# EasyEDA Pro project ax08_duplicate.eprj, schematic ax08 1.0

## Sheets
1 register file: Board Name: ax08 1.0; Create Date: 2025-06-18; Page Name: register file; Project Name: ax08; Schematic Name: ax08 1.0; Update Date: 2025-06-18; Company: EasyEDA.com; Page Size: A4; Version: V1.0
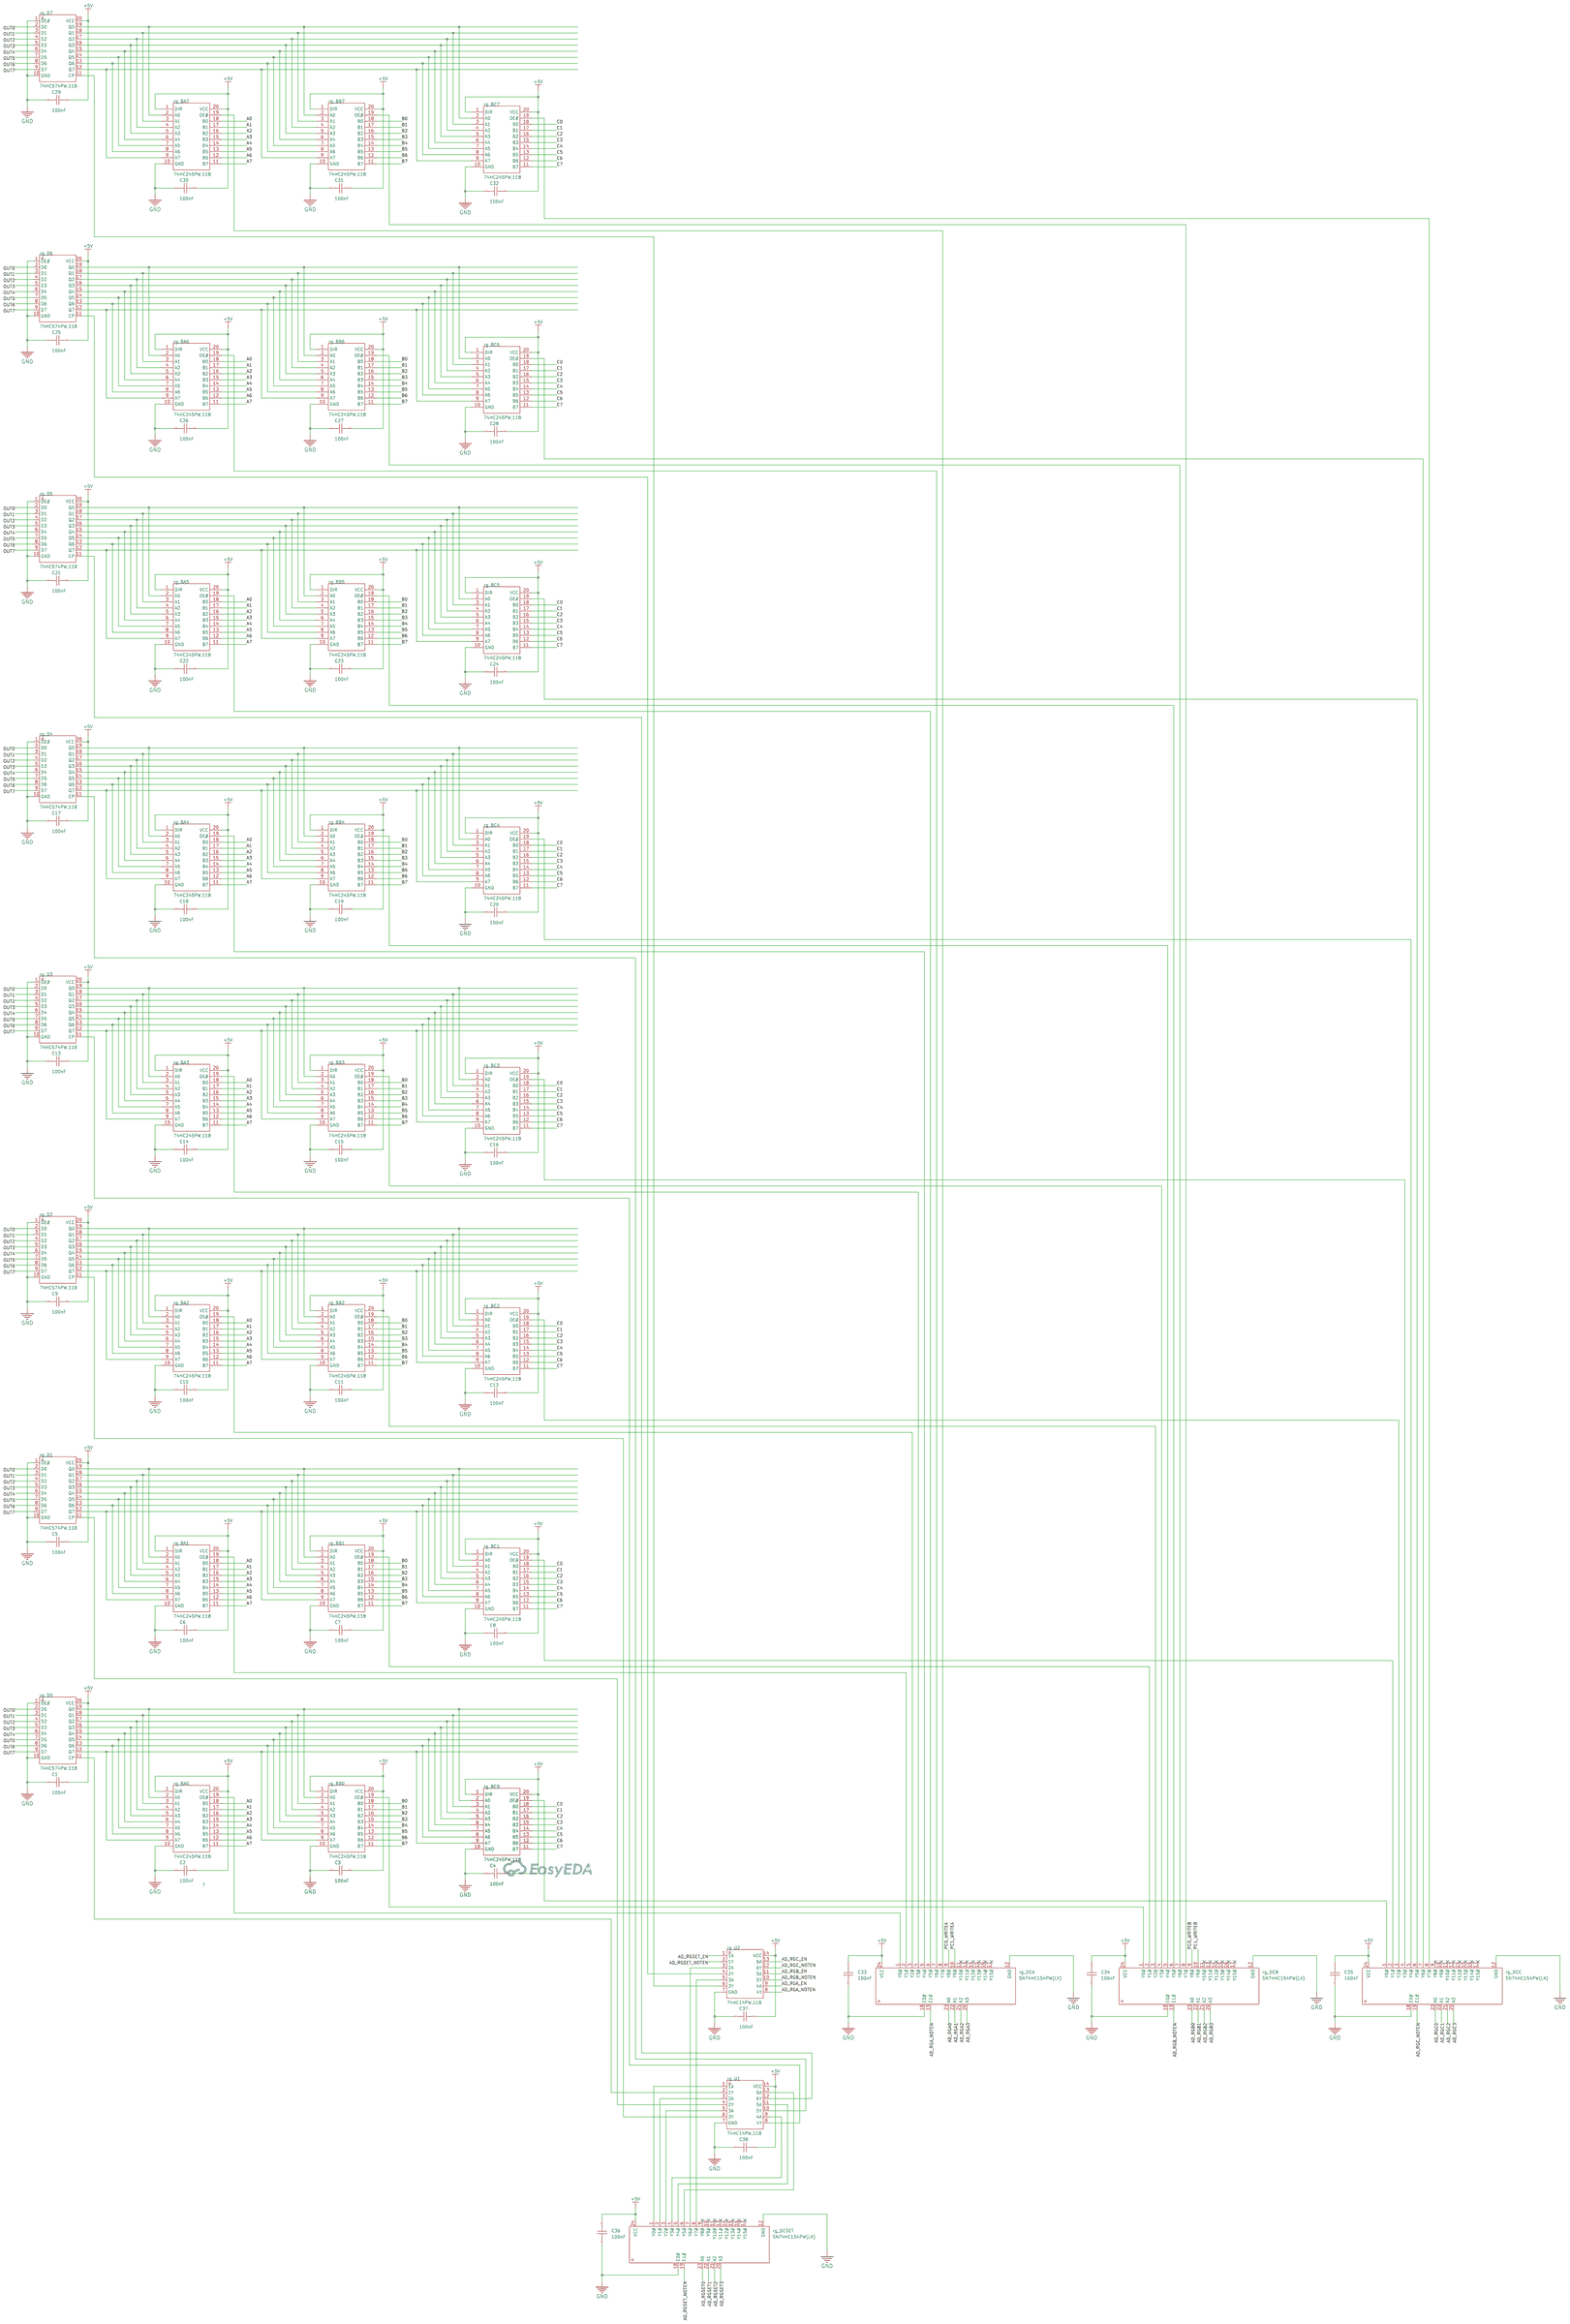
[diagram p0: register file]
2 pc: Page Name: pc
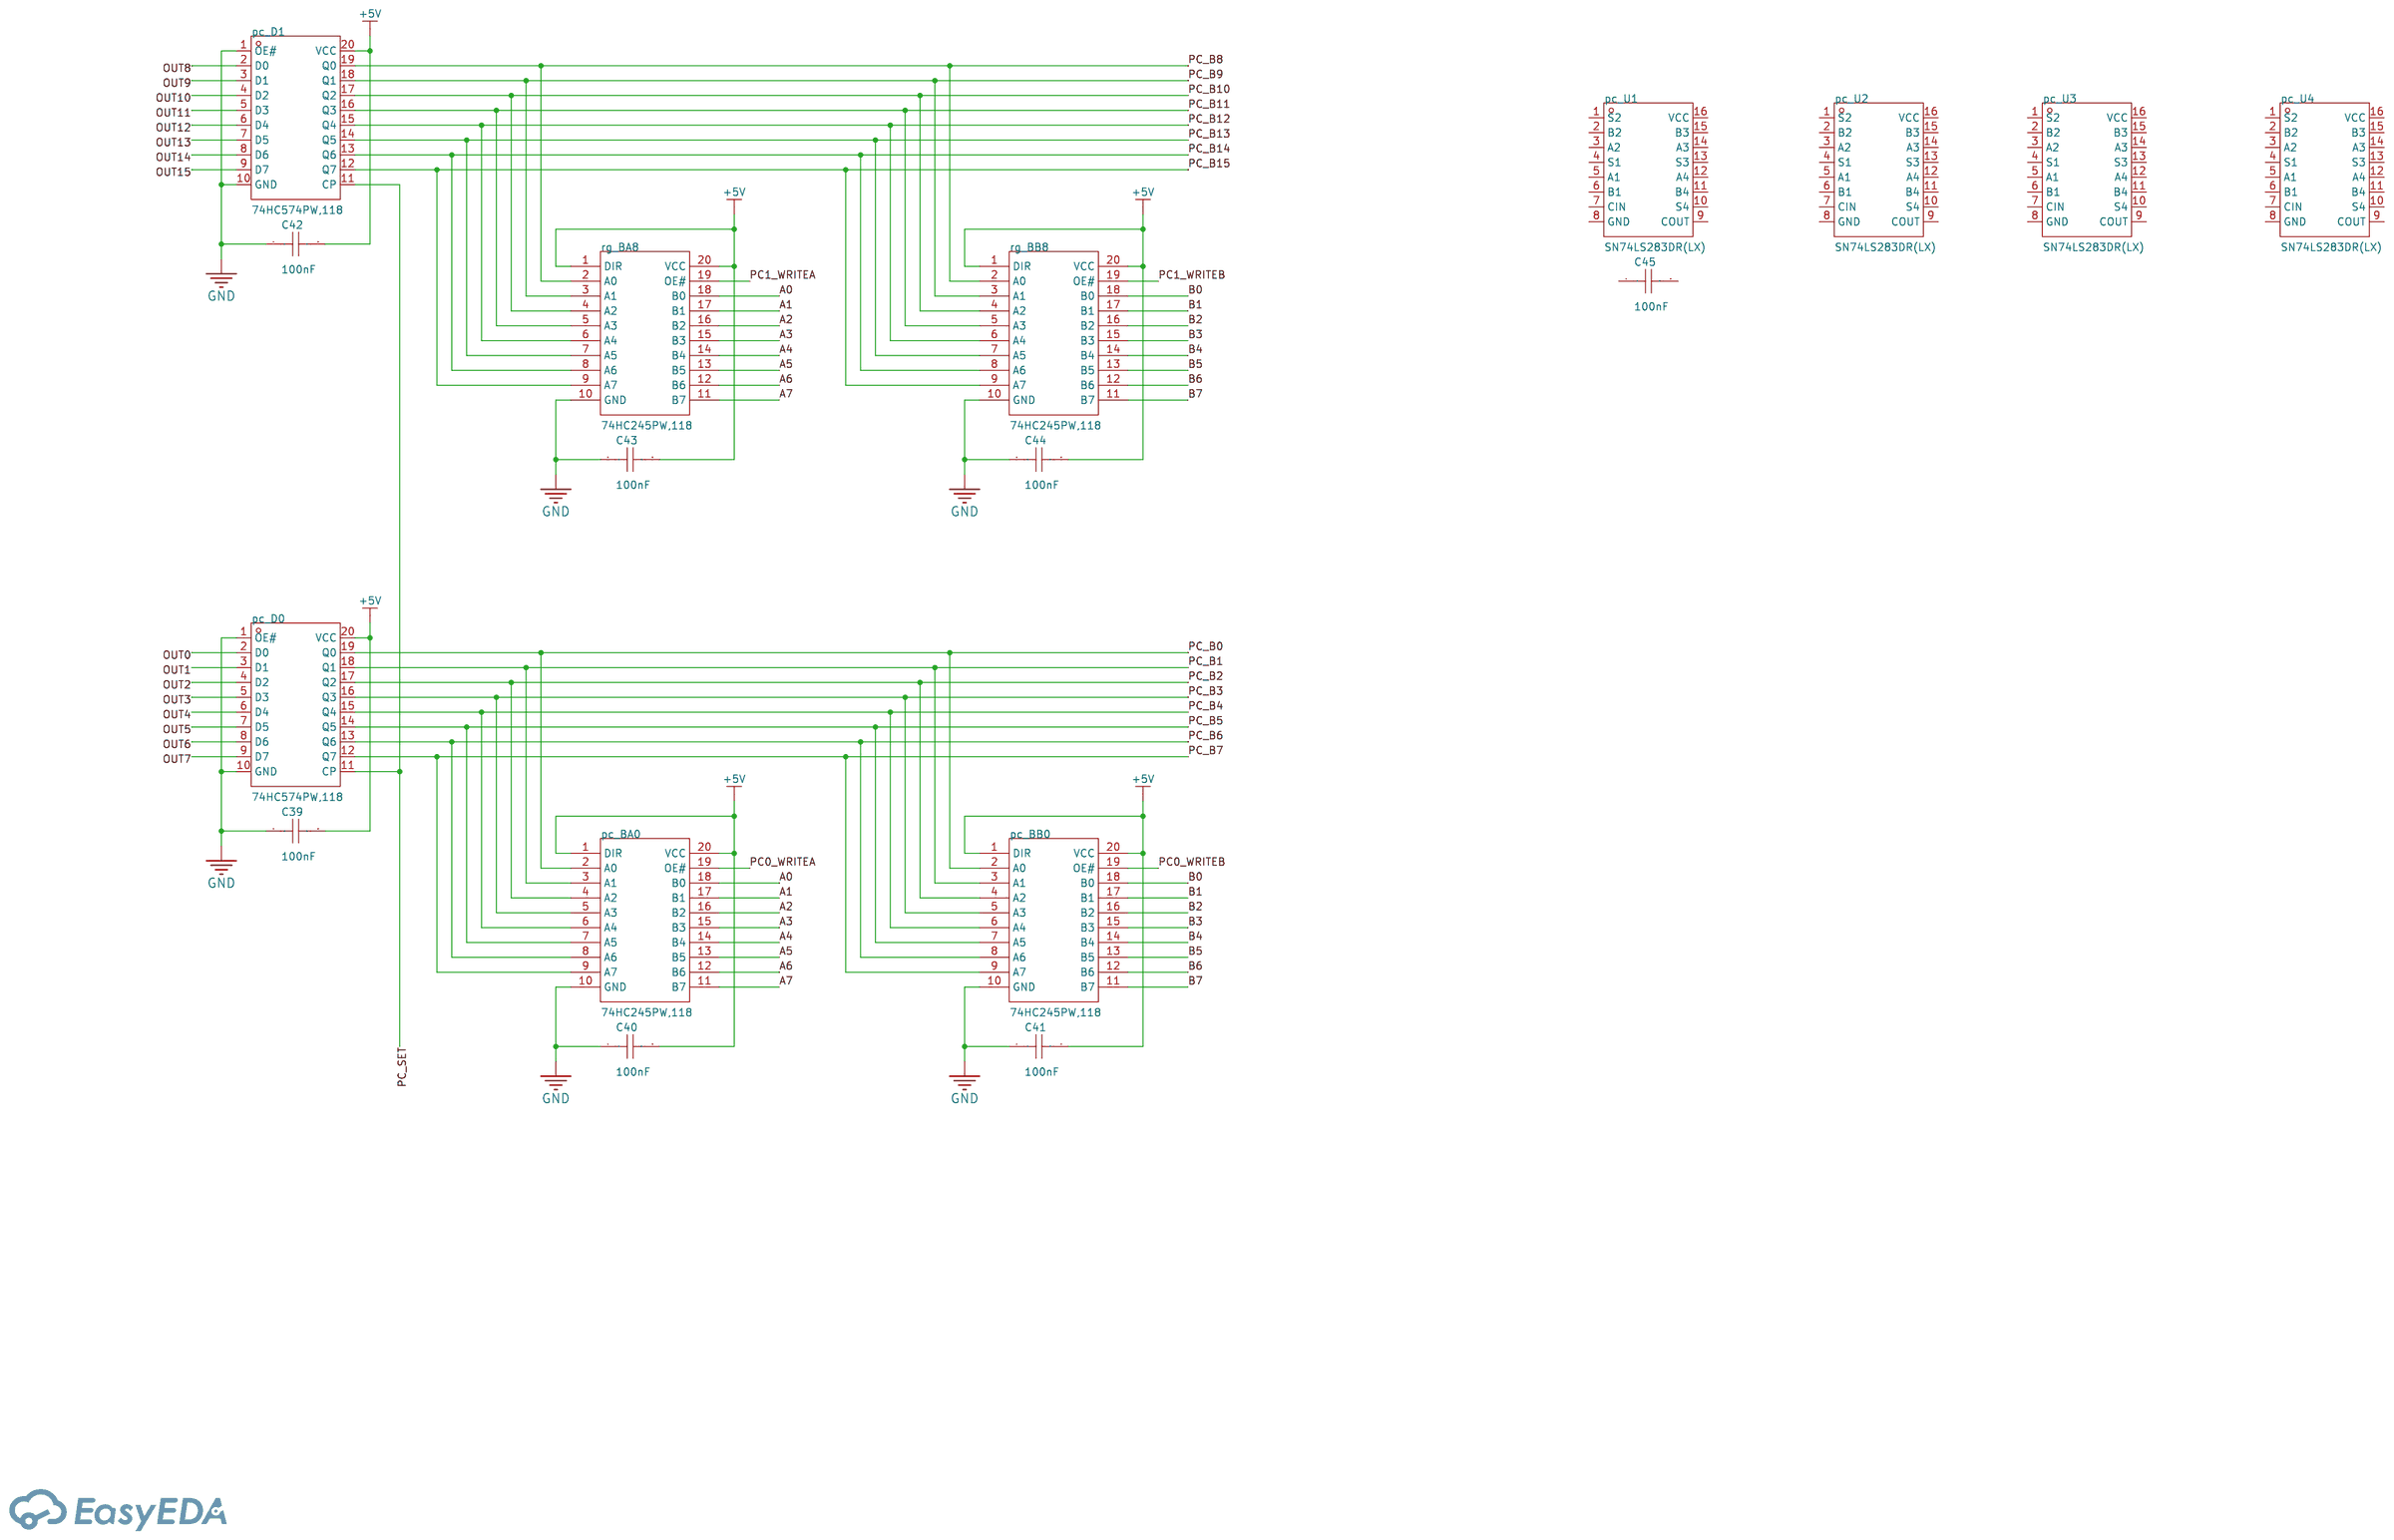
[diagram p1: pc]

## Parts
sheet pc
C39  100nF  [C0805]
C40  100nF  [C0805]
C41  100nF  [C0805]
C42  100nF  [C0805]
C43  100nF  [C0805]
C44  100nF  [C0805]
C45  100nF  [C0805]
pc_BA0  74HC245PW,118  [TSSOP-20_L6.5-W4.4-P0.65-LS6.4-BL]
pc_BB0  74HC245PW,118  [TSSOP-20_L6.5-W4.4-P0.65-LS6.4-BL]
pc_D0  74HC574PW,118  [TSSOP-20_L6.5-W4.4-P0.65-LS6.4-BL]
pc_D1  74HC574PW,118  [TSSOP-20_L6.5-W4.4-P0.65-LS6.4-BL]
pc_U1  SN74LS283DR(LX)  [SOIC-16_L9.9-W3.9-P1.27-LS6.0-BL-1]
pc_U2  SN74LS283DR(LX)  [SOIC-16_L9.9-W3.9-P1.27-LS6.0-BL-1]
pc_U3  SN74LS283DR(LX)  [SOIC-16_L9.9-W3.9-P1.27-LS6.0-BL-1]
pc_U4  SN74LS283DR(LX)  [SOIC-16_L9.9-W3.9-P1.27-LS6.0-BL-1]
rg_BA8  74HC245PW,118  [TSSOP-20_L6.5-W4.4-P0.65-LS6.4-BL]
rg_BB8  74HC245PW,118  [TSSOP-20_L6.5-W4.4-P0.65-LS6.4-BL]
sheet register file
C1  100nF  [C0805]
C2  100nF  [C0805]
C3  100nF  [C0805]
C4  100nF  [C0805]
C5  100nF  [C0805]
C6  100nF  [C0805]
C7  100nF  [C0805]
C8  100nF  [C0805]
C9  100nF  [C0805]
C10  100nF  [C0805]
C11  100nF  [C0805]
C12  100nF  [C0805]
C13  100nF  [C0805]
C14  100nF  [C0805]
C15  100nF  [C0805]
C16  100nF  [C0805]
C17  100nF  [C0805]
C18  100nF  [C0805]
C19  100nF  [C0805]
C20  100nF  [C0805]
C21  100nF  [C0805]
C22  100nF  [C0805]
C23  100nF  [C0805]
C24  100nF  [C0805]
C25  100nF  [C0805]
C26  100nF  [C0805]
C27  100nF  [C0805]
C28  100nF  [C0805]
C29  100nF  [C0805]
C30  100nF  [C0805]
C31  100nF  [C0805]
C32  100nF  [C0805]
C33  100nF  [C0805]
C34  100nF  [C0805]
C35  100nF  [C0805]
C36  100nF  [C0805]
C37  100nF  [C0805]
C38  100nF  [C0805]
rg_BA0  74HC245PW,118  [TSSOP-20_L6.5-W4.4-P0.65-LS6.4-BL]
rg_BA1  74HC245PW,118  [TSSOP-20_L6.5-W4.4-P0.65-LS6.4-BL]
rg_BA2  74HC245PW,118  [TSSOP-20_L6.5-W4.4-P0.65-LS6.4-BL]
rg_BA3  74HC245PW,118  [TSSOP-20_L6.5-W4.4-P0.65-LS6.4-BL]
rg_BA4  74HC245PW,118  [TSSOP-20_L6.5-W4.4-P0.65-LS6.4-BL]
rg_BA5  74HC245PW,118  [TSSOP-20_L6.5-W4.4-P0.65-LS6.4-BL]
rg_BA6  74HC245PW,118  [TSSOP-20_L6.5-W4.4-P0.65-LS6.4-BL]
rg_BA7  74HC245PW,118  [TSSOP-20_L6.5-W4.4-P0.65-LS6.4-BL]
rg_BB0  74HC245PW,118  [TSSOP-20_L6.5-W4.4-P0.65-LS6.4-BL]
rg_BB1  74HC245PW,118  [TSSOP-20_L6.5-W4.4-P0.65-LS6.4-BL]
rg_BB2  74HC245PW,118  [TSSOP-20_L6.5-W4.4-P0.65-LS6.4-BL]
rg_BB3  74HC245PW,118  [TSSOP-20_L6.5-W4.4-P0.65-LS6.4-BL]
rg_BB4  74HC245PW,118  [TSSOP-20_L6.5-W4.4-P0.65-LS6.4-BL]
rg_BB5  74HC245PW,118  [TSSOP-20_L6.5-W4.4-P0.65-LS6.4-BL]
rg_BB6  74HC245PW,118  [TSSOP-20_L6.5-W4.4-P0.65-LS6.4-BL]
rg_BB7  74HC245PW,118  [TSSOP-20_L6.5-W4.4-P0.65-LS6.4-BL]
rg_BC0  74HC245PW,118  [TSSOP-20_L6.5-W4.4-P0.65-LS6.4-BL]
rg_BC1  74HC245PW,118  [TSSOP-20_L6.5-W4.4-P0.65-LS6.4-BL]
rg_BC2  74HC245PW,118  [TSSOP-20_L6.5-W4.4-P0.65-LS6.4-BL]
rg_BC3  74HC245PW,118  [TSSOP-20_L6.5-W4.4-P0.65-LS6.4-BL]
rg_BC4  74HC245PW,118  [TSSOP-20_L6.5-W4.4-P0.65-LS6.4-BL]
rg_BC5  74HC245PW,118  [TSSOP-20_L6.5-W4.4-P0.65-LS6.4-BL]
rg_BC6  74HC245PW,118  [TSSOP-20_L6.5-W4.4-P0.65-LS6.4-BL]
rg_BC7  74HC245PW,118  [TSSOP-20_L6.5-W4.4-P0.65-LS6.4-BL]
rg_D0  74HC574PW,118  [TSSOP-20_L6.5-W4.4-P0.65-LS6.4-BL]
rg_D1  74HC574PW,118  [TSSOP-20_L6.5-W4.4-P0.65-LS6.4-BL]
rg_D2  74HC574PW,118  [TSSOP-20_L6.5-W4.4-P0.65-LS6.4-BL]
rg_D3  74HC574PW,118  [TSSOP-20_L6.5-W4.4-P0.65-LS6.4-BL]
rg_D4  74HC574PW,118  [TSSOP-20_L6.5-W4.4-P0.65-LS6.4-BL]
rg_D5  74HC574PW,118  [TSSOP-20_L6.5-W4.4-P0.65-LS6.4-BL]
rg_D6  74HC574PW,118  [TSSOP-20_L6.5-W4.4-P0.65-LS6.4-BL]
rg_D7  74HC574PW,118  [TSSOP-20_L6.5-W4.4-P0.65-LS6.4-BL]
rg_DCA  SN74HC154PW(LX)  [TSSOP-24_L7.8-W4.4-P0.65-LS6.4-BL_1]
rg_DCB  SN74HC154PW(LX)  [TSSOP-24_L7.8-W4.4-P0.65-LS6.4-BL_1]
rg_DCC  SN74HC154PW(LX)  [TSSOP-24_L7.8-W4.4-P0.65-LS6.4-BL_1]
rg_DCSET  SN74HC154PW(LX)  [TSSOP-24_L7.8-W4.4-P0.65-LS6.4-BL_1]
rg_U1  74HC14PW,118  [TSSOP-14_L5.0-W4.4-P0.65-LS6.4-BL]
rg_U2  74HC14PW,118  [TSSOP-14_L5.0-W4.4-P0.65-LS6.4-BL]

## Library data of the parts
C1-C45 = CC0805KRX7R9BB104: Capacitance: Tolerance:±10% Tolerance:±10% Voltage Rated: Temperature Coefficient:; LCSC Part Name: 100nF ±10% 50V; Supplier Part: C49678; Manufacturer: YAGEO(国巨); Supplier Footprint: 0805; JLCPCB Part Class: Basic Part; Datasheet: https://atta.szlcsc.com/upload/public/pdf/source/20180224/C181747_15194369449651363981.pdf; Supplier: LCSC; Tolerance: ±10%
pc_BA0 pc_BB0 rg_BA0-rg_BA8 rg_BB0-rg_BB8 rg_BC0-rg_BC7 = 74HC245PW,118: Input type:- output type:Tri-State Supply Voltage:2V~6V Supply Voltage:2V~6V Number of Elements:1 Number of Bits per Element:8 Channel Type:- Sink Current:7.8mA Source Current:7.8mA Logic Family:74HC Operating Temperature:-40℃~+125℃ Operating Temperature:; Supplier Part: C5626; Manufacturer: Nexperia(安世); Supplier Footprint: TSSOP-20; JLCPCB Part Class: Extended Part; Datasheet: https://atta.szlcsc.com/upload/public/pdf/source/20240724/EDC8C45902BA97AEC59E8811E3964917.pdf; Supplier: LCSC; output type: Tri-State; Supply Voltage: 2V~6V; Number of Elements: 1; Number of Bits per Element: 8; Sink Current: 7.8mA; Source Current: 7.8mA; Logic Family: 74HC; Operating Temperature: -40℃~+125℃
pc_D0 pc_D1 rg_D0-rg_D7 = 74HC574PW,118: Type:D-Type Trigger Type:Rising Edge Supply Voltage:2V~6V Supply Voltage:2V~6V Clock Frequency:133MHz Function: Number of Elements:1 Number of Bits per Element:8 Output Type: Maximum Propagation Delay:26ns@6V,50pF Series:74HCSeries Sink Current:7.8mA Sour; Supplier Part: C93762; Manufacturer: Nexperia(安世); Supplier Footprint: TSSOP-20; JLCPCB Part Class: Extended Part; Datasheet: https://atta.szlcsc.com/upload/public/pdf/source/20230809/78F4E93A48B1813E6DF94573D4B43A3E.pdf; Supplier: LCSC; Type: D-Type; Trigger Type: Rising Edge; Supply Voltage: 2V~6V; Clock Frequency: 133MHz; Number of Elements: 1; Number of Bits per Element: 8; Maximum Propagation Delay: 26ns@6V,50pF; Series: 74HCSeries; Sink Current: 7.8mA; Source Current: 7.8mA; Quiescent Current (Iq): 8uA; Input Capacitance: 3.5pF; Operating Temperature: -40℃~+125℃
pc_U1-pc_U4 = SN74LS283DR(LX): Supplier Part: C22374103; Manufacturer: LX(灵星芯微); Supplier Footprint: SOP-16; JLCPCB Part Class: Extended Part; Datasheet: https://atta.szlcsc.com/upload/public/pdf/source/20240402/80BBEEF0EDCF1C8215BAA06339FE4235.pdf; Supplier: LCSC; Logic Type: Binary Full Adder; Number of Channels: 4; Supply Voltage: 2V~6V; Operating Temperature: -40℃~+125℃
rg_DCA rg_DCB rg_DCC rg_DCSET = SN74HC154PW(LX): Type:Decoder/Demultiplexers Voltage Supply Source:Single supply Supply Voltage:2V~6V Supply Voltage:2V~6V Number of lines:4~16 Number of lines:4~16 Sink Current:- Source Current:- Operating temperature:-40℃~+125℃ Operating temperature:-40℃~+125℃; Supplier Part: C41413100; Manufacturer: LX(灵星芯微); Supplier Footprint: TSSOP-24; JLCPCB Part Class: Extended Part; Datasheet: https://atta.szlcsc.com/upload/public/pdf/source/20240923/0BF8EBFBC2EE7843BBF2E86797CF806E.pdf; Supplier: LCSC; Type: Decoder/Demultiplexers; Voltage Supply Source: Single supply; Supply Voltage: 2V~6V; Number of lines: 4~16; Operating temperature: -40℃~+125℃
rg_U1 rg_U2 = 74HC14PW,118: Input Type:Schmitt Trigger Supply Voltage(Single):2V~6V Supply Voltage(Single):2V~6V Supply Current (Max):2uA Number of Circuits:6 Number of Inputs:1 Sink Current:5.2mA Source Current:5.2mA High level range (VIH):1.5V~4.2V High level range (VIH):1.5V~4.2V; LCSC Part Name: 六路施密特触发反相器; Supplier Part: C5606; Manufacturer: Nexperia(安世); Supplier Footprint: TSSOP-14; JLCPCB Part Class: Extended Part; Datasheet: https://atta.szlcsc.com/upload/public/pdf/source/20170918/C131315_1505726904049976307.pdf; Supplier: LCSC; Input Type: Schmitt Trigger; Supply Voltage(Single): 2V~6V; Supply Current (Max): 2uA; Number of Circuits: 6; Number of Inputs: 1; Sink Current: 5.2mA; Source Current: 5.2mA; High level range (VIH): 1.5V~4.2V; Low level range (VIL): 300mV~1.2V; Max Propagation Delay: 21ns@6V,50pF; Series: 74HCSeries; Operating Temperature: -40℃~+125℃

## Nets
+5V: C1.2 C2.2 C3.2 C4.2 C5.2 C6.2 C7.2 C8.2 C9.2 C10.2 C11.2 C12.2 C13.2 C14.2 C15.2 C16.2 C17.2 C18.2 C19.2 C20.2 C21.2 C22.2 C23.2 C24.2 C25.2 C26.2 C27.2 C28.2 C29.2 C30.2 C31.2 C32.2 C33.1 C34.1 C35.1 C36.1 C37.2 C38.2 C39.2 C40.2 C41.2 C42.2 C43.2 C44.2 pc_BA0.1(DIR) pc_BA0.20(VCC) pc_BB0.1(DIR) pc_BB0.20(VCC) pc_D0.20(VCC) pc_D1.20(VCC) rg_BA0.1(DIR) rg_BA0.20(VCC) rg_BA1.1(DIR) rg_BA1.20(VCC) rg_BA2.1(DIR) rg_BA2.20(VCC) rg_BA3.1(DIR) rg_BA3.20(VCC) rg_BA4.1(DIR) rg_BA4.20(VCC) rg_BA5.1(DIR) rg_BA5.20(VCC) rg_BA6.1(DIR) rg_BA6.20(VCC) rg_BA7.1(DIR) rg_BA7.20(VCC) rg_BA8.1(DIR) rg_BA8.20(VCC) rg_BB0.1(DIR) rg_BB0.20(VCC) rg_BB1.1(DIR) rg_BB1.20(VCC) rg_BB2.1(DIR) rg_BB2.20(VCC) rg_BB3.1(DIR) rg_BB3.20(VCC) rg_BB4.1(DIR) rg_BB4.20(VCC) rg_BB5.1(DIR) rg_BB5.20(VCC) rg_BB6.1(DIR) rg_BB6.20(VCC) rg_BB7.1(DIR) rg_BB7.20(VCC) rg_BB8.1(DIR) rg_BB8.20(VCC) rg_BC0.1(DIR) rg_BC0.20(VCC) rg_BC1.1(DIR) rg_BC1.20(VCC) rg_BC2.1(DIR) rg_BC2.20(VCC) rg_BC3.1(DIR) rg_BC3.20(VCC) rg_BC4.1(DIR) rg_BC4.20(VCC) rg_BC5.1(DIR) rg_BC5.20(VCC) rg_BC6.1(DIR) rg_BC6.20(VCC) rg_BC7.1(DIR) rg_BC7.20(VCC) rg_D0.20(VCC) rg_D1.20(VCC) rg_D2.20(VCC) rg_D3.20(VCC) rg_D4.20(VCC) rg_D5.20(VCC) rg_D6.20(VCC) rg_D7.20(VCC) rg_DCA.24(VCC) rg_DCB.24(VCC) rg_DCC.24(VCC) rg_DCSET.24(VCC) rg_U1.14(VCC) rg_U2.14(VCC)
GND: C1.1 C2.1 C3.1 C4.1 C5.1 C6.1 C7.1 C8.1 C9.1 C10.1 C11.1 C12.1 C13.1 C14.1 C15.1 C16.1 C17.1 C18.1 C19.1 C20.1 C21.1 C22.1 C23.1 C24.1 C25.1 C26.1 C27.1 C28.1 C29.1 C30.1 C31.1 C32.1 C33.2 C34.2 C35.2 C36.2 C37.1 C38.1 C39.1 C40.1 C41.1 C42.1 C43.1 C44.1 pc_BA0.10(GND) pc_BB0.10(GND) pc_D0.1(OE#) pc_D0.10(GND) pc_D1.1(OE#) pc_D1.10(GND) rg_BA0.10(GND) rg_BA1.10(GND) rg_BA2.10(GND) rg_BA3.10(GND) rg_BA4.10(GND) rg_BA5.10(GND) rg_BA6.10(GND) rg_BA7.10(GND) rg_BA8.10(GND) rg_BB0.10(GND) rg_BB1.10(GND) rg_BB2.10(GND) rg_BB3.10(GND) rg_BB4.10(GND) rg_BB5.10(GND) rg_BB6.10(GND) rg_BB7.10(GND) rg_BB8.10(GND) rg_BC0.10(GND) rg_BC1.10(GND) rg_BC2.10(GND) rg_BC3.10(GND) rg_BC4.10(GND) rg_BC5.10(GND) rg_BC6.10(GND) rg_BC7.10(GND) rg_D0.1(OE#) rg_D0.10(GND) rg_D1.1(OE#) rg_D1.10(GND) rg_D2.1(OE#) rg_D2.10(GND) rg_D3.1(OE#) rg_D3.10(GND) rg_D4.1(OE#) rg_D4.10(GND) rg_D5.1(OE#) rg_D5.10(GND) rg_D6.1(OE#) rg_D6.10(GND) rg_D7.1(OE#) rg_D7.10(GND) rg_DCA.12(GND) rg_DCA.18(E0#) rg_DCB.12(GND) rg_DCB.18(E0#) rg_DCC.12(GND) rg_DCC.18(E0#) rg_DCSET.12(GND) rg_DCSET.18(E0#) rg_U1.7(GND) rg_U2.7(GND)
A0: pc_BA0.18(B0) rg_BA0.18(B0) rg_BA1.18(B0) rg_BA2.18(B0) rg_BA3.18(B0) rg_BA4.18(B0) rg_BA5.18(B0) rg_BA6.18(B0) rg_BA7.18(B0) rg_BA8.18(B0)
A1: pc_BA0.17(B1) rg_BA0.17(B1) rg_BA1.17(B1) rg_BA2.17(B1) rg_BA3.17(B1) rg_BA4.17(B1) rg_BA5.17(B1) rg_BA6.17(B1) rg_BA7.17(B1) rg_BA8.17(B1)
A2: pc_BA0.16(B2) rg_BA0.16(B2) rg_BA1.16(B2) rg_BA2.16(B2) rg_BA3.16(B2) rg_BA4.16(B2) rg_BA5.16(B2) rg_BA6.16(B2) rg_BA7.16(B2) rg_BA8.16(B2)
A3: pc_BA0.15(B3) rg_BA0.15(B3) rg_BA1.15(B3) rg_BA2.15(B3) rg_BA3.15(B3) rg_BA4.15(B3) rg_BA5.15(B3) rg_BA6.15(B3) rg_BA7.15(B3) rg_BA8.15(B3)
A4: pc_BA0.14(B4) rg_BA0.14(B4) rg_BA1.14(B4) rg_BA2.14(B4) rg_BA3.14(B4) rg_BA4.14(B4) rg_BA5.14(B4) rg_BA6.14(B4) rg_BA7.14(B4) rg_BA8.14(B4)
A5: pc_BA0.13(B5) rg_BA0.13(B5) rg_BA1.13(B5) rg_BA2.13(B5) rg_BA3.13(B5) rg_BA4.13(B5) rg_BA5.13(B5) rg_BA6.13(B5) rg_BA7.13(B5) rg_BA8.13(B5)
A6: pc_BA0.12(B6) rg_BA0.12(B6) rg_BA1.12(B6) rg_BA2.12(B6) rg_BA3.12(B6) rg_BA4.12(B6) rg_BA5.12(B6) rg_BA6.12(B6) rg_BA7.12(B6) rg_BA8.12(B6)
A7: pc_BA0.11(B7) rg_BA0.11(B7) rg_BA1.11(B7) rg_BA2.11(B7) rg_BA3.11(B7) rg_BA4.11(B7) rg_BA5.11(B7) rg_BA6.11(B7) rg_BA7.11(B7) rg_BA8.11(B7)
AD_RGA0: rg_DCA.23(A0)
AD_RGA1: rg_DCA.22(A1)
AD_RGA2: rg_DCA.21(A2)
AD_RGA3: rg_DCA.20(A3)
AD_RGA_EN: rg_U2.9(4A)
AD_RGA_NOTEN: rg_DCA.19(E1#) rg_U2.8(4Y)
AD_RGB0: rg_DCB.23(A0)
AD_RGB1: rg_DCB.22(A1)
AD_RGB2: rg_DCB.21(A2)
AD_RGB3: rg_DCB.20(A3)
AD_RGB_EN: rg_U2.11(5A)
AD_RGB_NOTEN: rg_DCB.19(E1#) rg_U2.10(5Y)
AD_RGC0: rg_DCC.23(A0)
AD_RGC1: rg_DCC.22(A1)
AD_RGC2: rg_DCC.21(A2)
AD_RGC3: rg_DCC.20(A3)
AD_RGC_EN: rg_U2.13(6A)
AD_RGC_NOTEN: rg_DCC.19(E1#) rg_U2.12(6Y)
AD_RGSET0: rg_DCSET.23(A0)
AD_RGSET1: rg_DCSET.22(A1)
AD_RGSET2: rg_DCSET.21(A2)
AD_RGSET3: rg_DCSET.20(A3)
AD_RGSET_EN: rg_U2.1(1A)
AD_RGSET_NOTEN: rg_DCSET.19(E1#) rg_U2.2(1Y)
B0: pc_BB0.18(B0) rg_BB0.18(B0) rg_BB1.18(B0) rg_BB2.18(B0) rg_BB3.18(B0) rg_BB4.18(B0) rg_BB5.18(B0) rg_BB6.18(B0) rg_BB7.18(B0) rg_BB8.18(B0)
B1: pc_BB0.17(B1) rg_BB0.17(B1) rg_BB1.17(B1) rg_BB2.17(B1) rg_BB3.17(B1) rg_BB4.17(B1) rg_BB5.17(B1) rg_BB6.17(B1) rg_BB7.17(B1) rg_BB8.17(B1)
B2: pc_BB0.16(B2) rg_BB0.16(B2) rg_BB1.16(B2) rg_BB2.16(B2) rg_BB3.16(B2) rg_BB4.16(B2) rg_BB5.16(B2) rg_BB6.16(B2) rg_BB7.16(B2) rg_BB8.16(B2)
B3: pc_BB0.15(B3) rg_BB0.15(B3) rg_BB1.15(B3) rg_BB2.15(B3) rg_BB3.15(B3) rg_BB4.15(B3) rg_BB5.15(B3) rg_BB6.15(B3) rg_BB7.15(B3) rg_BB8.15(B3)
B4: pc_BB0.14(B4) rg_BB0.14(B4) rg_BB1.14(B4) rg_BB2.14(B4) rg_BB3.14(B4) rg_BB4.14(B4) rg_BB5.14(B4) rg_BB6.14(B4) rg_BB7.14(B4) rg_BB8.14(B4)
B5: pc_BB0.13(B5) rg_BB0.13(B5) rg_BB1.13(B5) rg_BB2.13(B5) rg_BB3.13(B5) rg_BB4.13(B5) rg_BB5.13(B5) rg_BB6.13(B5) rg_BB7.13(B5) rg_BB8.13(B5)
B6: pc_BB0.12(B6) rg_BB0.12(B6) rg_BB1.12(B6) rg_BB2.12(B6) rg_BB3.12(B6) rg_BB4.12(B6) rg_BB5.12(B6) rg_BB6.12(B6) rg_BB7.12(B6) rg_BB8.12(B6)
B7: pc_BB0.11(B7) rg_BB0.11(B7) rg_BB1.11(B7) rg_BB2.11(B7) rg_BB3.11(B7) rg_BB4.11(B7) rg_BB5.11(B7) rg_BB6.11(B7) rg_BB7.11(B7) rg_BB8.11(B7)
C0: rg_BC0.18(B0) rg_BC1.18(B0) rg_BC2.18(B0) rg_BC3.18(B0) rg_BC4.18(B0) rg_BC5.18(B0) rg_BC6.18(B0) rg_BC7.18(B0)
C1: rg_BC0.17(B1) rg_BC1.17(B1) rg_BC2.17(B1) rg_BC3.17(B1) rg_BC4.17(B1) rg_BC5.17(B1) rg_BC6.17(B1) rg_BC7.17(B1)
C2: rg_BC0.16(B2) rg_BC1.16(B2) rg_BC2.16(B2) rg_BC3.16(B2) rg_BC4.16(B2) rg_BC5.16(B2) rg_BC6.16(B2) rg_BC7.16(B2)
C3: rg_BC0.15(B3) rg_BC1.15(B3) rg_BC2.15(B3) rg_BC3.15(B3) rg_BC4.15(B3) rg_BC5.15(B3) rg_BC6.15(B3) rg_BC7.15(B3)
C4: rg_BC0.14(B4) rg_BC1.14(B4) rg_BC2.14(B4) rg_BC3.14(B4) rg_BC4.14(B4) rg_BC5.14(B4) rg_BC6.14(B4) rg_BC7.14(B4)
C5: rg_BC0.13(B5) rg_BC1.13(B5) rg_BC2.13(B5) rg_BC3.13(B5) rg_BC4.13(B5) rg_BC5.13(B5) rg_BC6.13(B5) rg_BC7.13(B5)
C6: rg_BC0.12(B6) rg_BC1.12(B6) rg_BC2.12(B6) rg_BC3.12(B6) rg_BC4.12(B6) rg_BC5.12(B6) rg_BC6.12(B6) rg_BC7.12(B6)
C7: rg_BC0.11(B7) rg_BC1.11(B7) rg_BC2.11(B7) rg_BC3.11(B7) rg_BC4.11(B7) rg_BC5.11(B7) rg_BC6.11(B7) rg_BC7.11(B7)
OUT0: pc_D0.2(D0) rg_D0.2(D0) rg_D1.2(D0) rg_D2.2(D0) rg_D3.2(D0) rg_D4.2(D0) rg_D5.2(D0) rg_D6.2(D0) rg_D7.2(D0)
OUT1: pc_D0.3(D1) rg_D0.3(D1) rg_D1.3(D1) rg_D2.3(D1) rg_D3.3(D1) rg_D4.3(D1) rg_D5.3(D1) rg_D6.3(D1) rg_D7.3(D1)
OUT2: pc_D0.4(D2) rg_D0.4(D2) rg_D1.4(D2) rg_D2.4(D2) rg_D3.4(D2) rg_D4.4(D2) rg_D5.4(D2) rg_D6.4(D2) rg_D7.4(D2)
OUT3: pc_D0.5(D3) rg_D0.5(D3) rg_D1.5(D3) rg_D2.5(D3) rg_D3.5(D3) rg_D4.5(D3) rg_D5.5(D3) rg_D6.5(D3) rg_D7.5(D3)
OUT4: pc_D0.6(D4) rg_D0.6(D4) rg_D1.6(D4) rg_D2.6(D4) rg_D3.6(D4) rg_D4.6(D4) rg_D5.6(D4) rg_D6.6(D4) rg_D7.6(D4)
OUT5: pc_D0.7(D5) rg_D0.7(D5) rg_D1.7(D5) rg_D2.7(D5) rg_D3.7(D5) rg_D4.7(D5) rg_D5.7(D5) rg_D6.7(D5) rg_D7.7(D5)
OUT6: pc_D0.8(D6) rg_D0.8(D6) rg_D1.8(D6) rg_D2.8(D6) rg_D3.8(D6) rg_D4.8(D6) rg_D5.8(D6) rg_D6.8(D6) rg_D7.8(D6)
OUT7: pc_D0.9(D7) rg_D0.9(D7) rg_D1.9(D7) rg_D2.9(D7) rg_D3.9(D7) rg_D4.9(D7) rg_D5.9(D7) rg_D6.9(D7) rg_D7.9(D7)
OUT8: pc_D1.2(D0)
OUT9: pc_D1.3(D1)
OUT10: pc_D1.4(D2)
OUT11: pc_D1.5(D3)
OUT12: pc_D1.6(D4)
OUT13: pc_D1.7(D5)
OUT14: pc_D1.8(D6)
OUT15: pc_D1.9(D7)
PC0_WRITEA: pc_BA0.19(OE#) rg_DCA.9(Y8#)
PC0_WRITEB: pc_BB0.19(OE#) rg_DCB.9(Y8#)
PC1_WRITEA: rg_BA8.19(OE#) rg_DCA.10(Y9#)
PC1_WRITEB: rg_BB8.19(OE#) rg_DCB.10(Y9#)
PC_B0: pc_BA0.2(A0) pc_BB0.2(A0) pc_D0.19(Q0)
PC_B1: pc_BA0.3(A1) pc_BB0.3(A1) pc_D0.18(Q1)
PC_B2: pc_BA0.4(A2) pc_BB0.4(A2) pc_D0.17(Q2)
PC_B3: pc_BA0.5(A3) pc_BB0.5(A3) pc_D0.16(Q3)
PC_B4: pc_BA0.6(A4) pc_BB0.6(A4) pc_D0.15(Q4)
PC_B5: pc_BA0.7(A5) pc_BB0.7(A5) pc_D0.14(Q5)
PC_B6: pc_BA0.8(A6) pc_BB0.8(A6) pc_D0.13(Q6)
PC_B7: pc_BA0.9(A7) pc_BB0.9(A7) pc_D0.12(Q7)
PC_B8: pc_D1.19(Q0) rg_BA8.2(A0) rg_BB8.2(A0)
PC_B9: pc_D1.18(Q1) rg_BA8.3(A1) rg_BB8.3(A1)
PC_B10: pc_D1.17(Q2) rg_BA8.4(A2) rg_BB8.4(A2)
PC_B11: pc_D1.16(Q3) rg_BA8.5(A3) rg_BB8.5(A3)
PC_B12: pc_D1.15(Q4) rg_BA8.6(A4) rg_BB8.6(A4)
PC_B13: pc_D1.14(Q5) rg_BA8.7(A5) rg_BB8.7(A5)
PC_B14: pc_D1.13(Q6) rg_BA8.8(A6) rg_BB8.8(A6)
PC_B15: pc_D1.12(Q7) rg_BA8.9(A7) rg_BB8.9(A7)
PC_SET: pc_D0.11(CP) pc_D1.11(CP)
$3N32152: rg_BA0.2(A0) rg_BB0.2(A0) rg_BC0.2(A0) rg_D0.19(Q0)
$3N32156: rg_BA0.3(A1) rg_BB0.3(A1) rg_BC0.3(A1) rg_D0.18(Q1)
$3N32160: rg_BA0.4(A2) rg_BB0.4(A2) rg_BC0.4(A2) rg_D0.17(Q2)
$3N32164: rg_BA0.5(A3) rg_BB0.5(A3) rg_BC0.5(A3) rg_D0.16(Q3)
$3N32168: rg_BA0.6(A4) rg_BB0.6(A4) rg_BC0.6(A4) rg_D0.15(Q4)
$3N32172: rg_BA0.7(A5) rg_BB0.7(A5) rg_BC0.7(A5) rg_D0.14(Q5)
$3N32176: rg_BA0.8(A6) rg_BB0.8(A6) rg_BC0.8(A6) rg_D0.13(Q6)
$3N32180: rg_BA0.9(A7) rg_BB0.9(A7) rg_BC0.9(A7) rg_D0.12(Q7)
$3N32219: rg_D0.11(CP) rg_U1.2(1Y)
$3N33083: rg_BC0.19(OE#) rg_DCC.1(Y0#)
$3N33089: rg_BB0.19(OE#) rg_DCB.1(Y0#)
$3N33095: rg_BA0.19(OE#) rg_DCA.1(Y0#)
$3N34941: rg_BA1.2(A0) rg_BB1.2(A0) rg_BC1.2(A0) rg_D1.19(Q0)
$3N34952: rg_BA1.3(A1) rg_BB1.3(A1) rg_BC1.3(A1) rg_D1.18(Q1)
$3N34963: rg_BA1.4(A2) rg_BB1.4(A2) rg_BC1.4(A2) rg_D1.17(Q2)
$3N34974: rg_BA1.5(A3) rg_BB1.5(A3) rg_BC1.5(A3) rg_D1.16(Q3)
$3N34985: rg_BA1.6(A4) rg_BB1.6(A4) rg_BC1.6(A4) rg_D1.15(Q4)
$3N34996: rg_BA1.7(A5) rg_BB1.7(A5) rg_BC1.7(A5) rg_D1.14(Q5)
$3N35007: rg_BA1.8(A6) rg_BB1.8(A6) rg_BC1.8(A6) rg_D1.13(Q6)
$3N35024: rg_D1.11(CP) rg_U1.4(2Y)
$3N35028: rg_BA1.9(A7) rg_BB1.9(A7) rg_BC1.9(A7) rg_D1.12(Q7)
$3N35077: rg_BC1.19(OE#) rg_DCC.2(Y1#)
$3N35081: rg_BB1.19(OE#) rg_DCB.2(Y1#)
$3N35085: rg_BA1.19(OE#) rg_DCA.2(Y1#)
$3N35770: rg_BA2.2(A0) rg_BB2.2(A0) rg_BC2.2(A0) rg_D2.19(Q0)
$3N35781: rg_BA2.3(A1) rg_BB2.3(A1) rg_BC2.3(A1) rg_D2.18(Q1)
$3N35792: rg_BA2.4(A2) rg_BB2.4(A2) rg_BC2.4(A2) rg_D2.17(Q2)
$3N35803: rg_BA2.5(A3) rg_BB2.5(A3) rg_BC2.5(A3) rg_D2.16(Q3)
$3N35814: rg_BA2.6(A4) rg_BB2.6(A4) rg_BC2.6(A4) rg_D2.15(Q4)
$3N35825: rg_BA2.7(A5) rg_BB2.7(A5) rg_BC2.7(A5) rg_D2.14(Q5)
$3N35836: rg_BA2.8(A6) rg_BB2.8(A6) rg_BC2.8(A6) rg_D2.13(Q6)
$3N35853: rg_D2.11(CP) rg_U1.6(3Y)
$3N35857: rg_BA2.9(A7) rg_BB2.9(A7) rg_BC2.9(A7) rg_D2.12(Q7)
$3N35906: rg_BC2.19(OE#) rg_DCC.3(Y2#)
$3N35910: rg_BB2.19(OE#) rg_DCB.3(Y2#)
$3N35914: rg_BA2.19(OE#) rg_DCA.3(Y2#)
$3N37420: rg_BA3.2(A0) rg_BB3.2(A0) rg_BC3.2(A0) rg_D3.19(Q0)
$3N37431: rg_BA3.3(A1) rg_BB3.3(A1) rg_BC3.3(A1) rg_D3.18(Q1)
$3N37442: rg_BA3.4(A2) rg_BB3.4(A2) rg_BC3.4(A2) rg_D3.17(Q2)
$3N37453: rg_BA3.5(A3) rg_BB3.5(A3) rg_BC3.5(A3) rg_D3.16(Q3)
$3N37464: rg_BA3.6(A4) rg_BB3.6(A4) rg_BC3.6(A4) rg_D3.15(Q4)
$3N37475: rg_BA3.7(A5) rg_BB3.7(A5) rg_BC3.7(A5) rg_D3.14(Q5)
$3N37486: rg_BA3.8(A6) rg_BB3.8(A6) rg_BC3.8(A6) rg_D3.13(Q6)
$3N37503: rg_D3.11(CP) rg_U1.8(4Y)
$3N37507: rg_BA3.9(A7) rg_BB3.9(A7) rg_BC3.9(A7) rg_D3.12(Q7)
$3N37556: rg_BC3.19(OE#) rg_DCC.4(Y3#)
$3N37560: rg_BB3.19(OE#) rg_DCB.4(Y3#)
$3N37564: rg_BA3.19(OE#) rg_DCA.4(Y3#)
$3N38249: rg_BA4.2(A0) rg_BB4.2(A0) rg_BC4.2(A0) rg_D4.19(Q0)
$3N38260: rg_BA4.3(A1) rg_BB4.3(A1) rg_BC4.3(A1) rg_D4.18(Q1)
$3N38271: rg_BA4.4(A2) rg_BB4.4(A2) rg_BC4.4(A2) rg_D4.17(Q2)
$3N38282: rg_BA4.5(A3) rg_BB4.5(A3) rg_BC4.5(A3) rg_D4.16(Q3)
$3N38293: rg_BA4.6(A4) rg_BB4.6(A4) rg_BC4.6(A4) rg_D4.15(Q4)
$3N38304: rg_BA4.7(A5) rg_BB4.7(A5) rg_BC4.7(A5) rg_D4.14(Q5)
$3N38315: rg_BA4.8(A6) rg_BB4.8(A6) rg_BC4.8(A6) rg_D4.13(Q6)
$3N38336: rg_BA4.9(A7) rg_BB4.9(A7) rg_BC4.9(A7) rg_D4.12(Q7)
$3N38385: rg_BC4.19(OE#) rg_DCC.5(Y4#)
$3N38389: rg_BB4.19(OE#) rg_DCB.5(Y4#)
$3N38393: rg_BA4.19(OE#) rg_DCA.5(Y4#)
$3N39078: rg_BA5.2(A0) rg_BB5.2(A0) rg_BC5.2(A0) rg_D5.19(Q0)
$3N39089: rg_BA5.3(A1) rg_BB5.3(A1) rg_BC5.3(A1) rg_D5.18(Q1)
$3N39100: rg_BA5.4(A2) rg_BB5.4(A2) rg_BC5.4(A2) rg_D5.17(Q2)
$3N39111: rg_BA5.5(A3) rg_BB5.5(A3) rg_BC5.5(A3) rg_D5.16(Q3)
$3N39122: rg_BA5.6(A4) rg_BB5.6(A4) rg_BC5.6(A4) rg_D5.15(Q4)
$3N39133: rg_BA5.7(A5) rg_BB5.7(A5) rg_BC5.7(A5) rg_D5.14(Q5)
$3N39144: rg_BA5.8(A6) rg_BB5.8(A6) rg_BC5.8(A6) rg_D5.13(Q6)
$3N39161: rg_D5.11(CP) rg_U1.12(6Y)
$3N39165: rg_BA5.9(A7) rg_BB5.9(A7) rg_BC5.9(A7) rg_D5.12(Q7)
$3N39214: rg_BC5.19(OE#) rg_DCC.6(Y5#)
$3N39218: rg_BB5.19(OE#) rg_DCB.6(Y5#)
$3N39222: rg_BA5.19(OE#) rg_DCA.6(Y5#)
$3N39907: rg_BA6.2(A0) rg_BB6.2(A0) rg_BC6.2(A0) rg_D6.19(Q0)
$3N39918: rg_BA6.3(A1) rg_BB6.3(A1) rg_BC6.3(A1) rg_D6.18(Q1)
$3N39929: rg_BA6.4(A2) rg_BB6.4(A2) rg_BC6.4(A2) rg_D6.17(Q2)
$3N39940: rg_BA6.5(A3) rg_BB6.5(A3) rg_BC6.5(A3) rg_D6.16(Q3)
$3N39951: rg_BA6.6(A4) rg_BB6.6(A4) rg_BC6.6(A4) rg_D6.15(Q4)
$3N39962: rg_BA6.7(A5) rg_BB6.7(A5) rg_BC6.7(A5) rg_D6.14(Q5)
$3N39973: rg_BA6.8(A6) rg_BB6.8(A6) rg_BC6.8(A6) rg_D6.13(Q6)
$3N39994: rg_BA6.9(A7) rg_BB6.9(A7) rg_BC6.9(A7) rg_D6.12(Q7)
$3N40043: rg_BC6.19(OE#) rg_DCC.7(Y6#)
$3N40047: rg_BB6.19(OE#) rg_DCB.7(Y6#)
$3N40051: rg_BA6.19(OE#) rg_DCA.7(Y6#)
$3N40736: rg_BA7.2(A0) rg_BB7.2(A0) rg_BC7.2(A0) rg_D7.19(Q0)
$3N40747: rg_BA7.3(A1) rg_BB7.3(A1) rg_BC7.3(A1) rg_D7.18(Q1)
$3N40758: rg_BA7.4(A2) rg_BB7.4(A2) rg_BC7.4(A2) rg_D7.17(Q2)
$3N40769: rg_BA7.5(A3) rg_BB7.5(A3) rg_BC7.5(A3) rg_D7.16(Q3)
$3N40780: rg_BA7.6(A4) rg_BB7.6(A4) rg_BC7.6(A4) rg_D7.15(Q4)
$3N40791: rg_BA7.7(A5) rg_BB7.7(A5) rg_BC7.7(A5) rg_D7.14(Q5)
$3N40802: rg_BA7.8(A6) rg_BB7.8(A6) rg_BC7.8(A6) rg_D7.13(Q6)
$3N40823: rg_BA7.9(A7) rg_BB7.9(A7) rg_BC7.9(A7) rg_D7.12(Q7)
$3N40872: rg_BC7.19(OE#) rg_DCC.8(Y7#)
$3N40876: rg_BB7.19(OE#) rg_DCB.8(Y7#)
$3N40880: rg_BA7.19(OE#) rg_DCA.8(Y7#)
$3N43090: rg_DCSET.1(Y0#) rg_U1.1(1A)
$3N43095: rg_DCSET.2(Y1#) rg_U1.3(2A)
$3N43100: rg_DCSET.3(Y2#) rg_U1.5(3A)
$3N43105: rg_DCSET.8(Y7#) rg_U2.5(3A)
$3N43110: rg_DCSET.7(Y6#) rg_U2.3(2A)
$3N43118: rg_DCSET.4(Y3#) rg_U1.9(4A)
$3N43125: rg_DCSET.5(Y4#) rg_U1.11(5A)
$3N43132: rg_DCSET.6(Y5#) rg_U1.13(6A)
$3N43161: rg_D4.11(CP) rg_U1.10(5Y)
$3N43175: rg_D6.11(CP) rg_U2.4(2Y)
$3N43180: rg_D7.11(CP) rg_U2.6(3Y)

Not connected (* = marked no-connect by the designer): C45 1 2; pc_U1 1(S2) 2(B2) 3(A2) 4(S1) 5(A1) 6(B1) 7(CIN) 8(GND) 9(COUT) 10(S4) 11(B4) 12(A4) 13(S3) 14(A3) 15(B3) 16(VCC); pc_U2 1(S2) 2(B2) 3(A2) 4(S1) 5(A1) 6(B1) 7(CIN) 8(GND) 9(COUT) 10(S4) 11(B4) 12(A4) 13(S3) 14(A3) 15(B3) 16(VCC); pc_U3 1(S2) 2(B2) 3(A2) 4(S1) 5(A1) 6(B1) 7(CIN) 8(GND) 9(COUT) 10(S4) 11(B4) 12(A4) 13(S3) 14(A3) 15(B3) 16(VCC); pc_U4 1(S2) 2(B2) 3(A2) 4(S1) 5(A1) 6(B1) 7(CIN) 8(GND) 9(COUT) 10(S4) 11(B4) 12(A4) 13(S3) 14(A3) 15(B3) 16(VCC); rg_DCA 11(Y10#)* 13(Y11#)* 14(Y12#)* 15(Y13#)* 16(Y14#)* 17(Y15#)*; rg_DCB 11(Y10#)* 13(Y11#)* 14(Y12#)* 15(Y13#)* 16(Y14#)* 17(Y15#)*; rg_DCC 9(Y8#)* 10(Y9#)* 11(Y10#)* 13(Y11#)* 14(Y12#)* 15(Y13#)* 16(Y14#)* 17(Y15#)*; rg_DCSET 9(Y8#)* 10(Y9#)* 11(Y10#)* 13(Y11#)* 14(Y12#)* 15(Y13#)* 16(Y14#)* 17(Y15#)*
